# Altium schematic sheet transformer.SchDoc
size A4; SheetNumber: 1; SheetTotal: 1
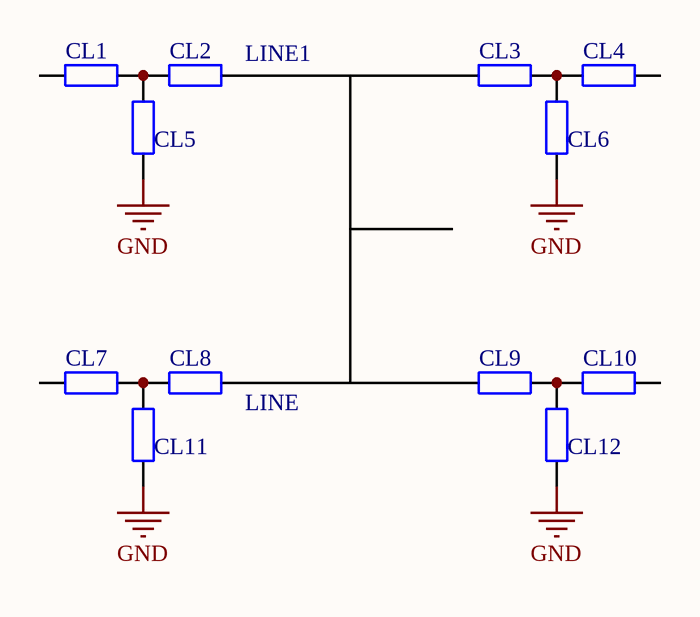
[diagram p0: transformer.SchDoc]

## Parts
CL1  CL_component  [RESISTOR]  (value not drawn)
CL2  CL_component  [RESISTOR]  (value not drawn)
CL3  CL_component  [RESISTOR]  (value not drawn)
CL4  CL_component  [RESISTOR]  (value not drawn)
CL5  CL_component  [RESISTOR]  (value not drawn)
CL6  CL_component  [RESISTOR]  (value not drawn)
CL7  CL_component  [RESISTOR]  (value not drawn)
CL8  CL_component  [RESISTOR]  (value not drawn)
CL9  CL_component  [RESISTOR]  (value not drawn)
CL10  CL_component  [RESISTOR]  (value not drawn)
CL11  CL_component  [RESISTOR]  (value not drawn)
CL12  CL_component  [RESISTOR]  (value not drawn)
LINE1  LINE  [LINE]

## Nets
GND: CL5.1 CL6.1 CL11.1 CL12.1
NetCL1_2: CL1.2 CL2.1 CL5.2
NetCL2_2: CL2.2 LINE1.1
NetCL3_1: CL3.1 LINE1.1
NetCL3_2: CL3.2 CL4.1 CL6.2
NetCL7_2: CL7.2 CL8.1 CL11.2
NetCL8_2: CL8.2 LINE1.1
NetCL9_1: CL9.1 LINE1.1
NetCL9_2: CL9.2 CL10.1 CL12.2

Not connected (* = marked no-connect by the designer): CL1 1; CL4 2; CL7 1; CL10 2